# EAGLE schematic PCB1_v1 (EAGLE 9.3.1)

## Sheet 1 of 4: Light Sensor
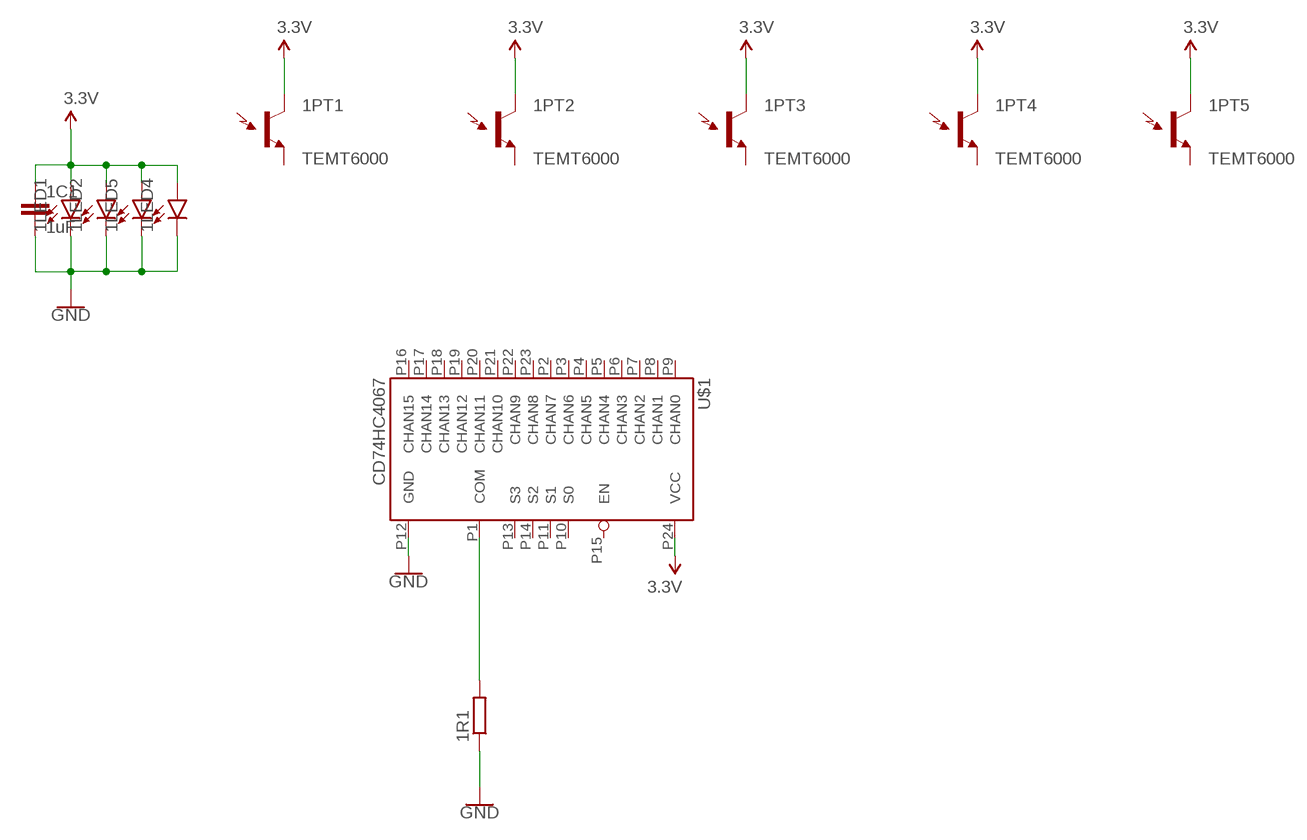
[diagram p0: schematic, sheet 1]

### Parts
1C1  1uF  C-EUC0603  [C0603]
1LED1  3528LED  [3528]
1LED2  3528LED  [3528]
1LED4  3528LED  [3528]
1LED5  3528LED  [3528]
1PT1  TEMT6000  LIGHT_SENSORTEMT6000  [TEMT6000]
1PT2  TEMT6000  LIGHT_SENSORTEMT6000  [TEMT6000]
1PT3  TEMT6000  LIGHT_SENSORTEMT6000  [TEMT6000]
1PT4  TEMT6000  LIGHT_SENSORTEMT6000  [TEMT6000]
1PT5  TEMT6000  LIGHT_SENSORTEMT6000  [TEMT6000]
1R1  2k  R-EU_R0603  [R0603]
U$1  CD74HC4067  [SOIC-24]

### Nets
3.3V: 1C1.1 1LED1.A 1LED2.A 1LED4.A 1LED5.A 1PT1.COLLECTOR(C1) 1PT2.COLLECTOR(C1) 1PT3.COLLECTOR(C1) 1PT4.COLLECTOR(C1) 1PT5.COLLECTOR(C1) U$1.P24(VCC) ; also sheet 2,3
GND: 1C1.2 1LED1.C 1LED2.C 1LED4.C 1LED5.C 1R1.1 U$1.P12(GND) ; also sheet 2,3
N$1: 1R1.2 U$1.P1(COM)
Unconnected: 1PT1.EMITTER(E1) 1PT2.EMITTER(E1) 1PT3.EMITTER(E1) 1PT4.EMITTER(E1) 1PT5.EMITTER(E1) U$1.P2(CHAN7) U$1.P3(CHAN6) U$1.P4(CHAN5) U$1.P5(CHAN4) U$1.P6(CHAN3) U$1.P7(CHAN2) U$1.P8(CHAN1) U$1.P9(CHAN0) U$1.P10(S0) U$1.P11(S1) U$1.P13(S3) U$1.P14(S2) U$1.P15(EN) U$1.P16(CHAN15) U$1.P17(CHAN14) U$1.P18(CHAN13) U$1.P19(CHAN12) U$1.P20(CHAN11) U$1.P21(CHAN10) U$1.P22(CHAN9) U$1.P23(CHAN8)

## Sheet 2 of 4: Motor Driver
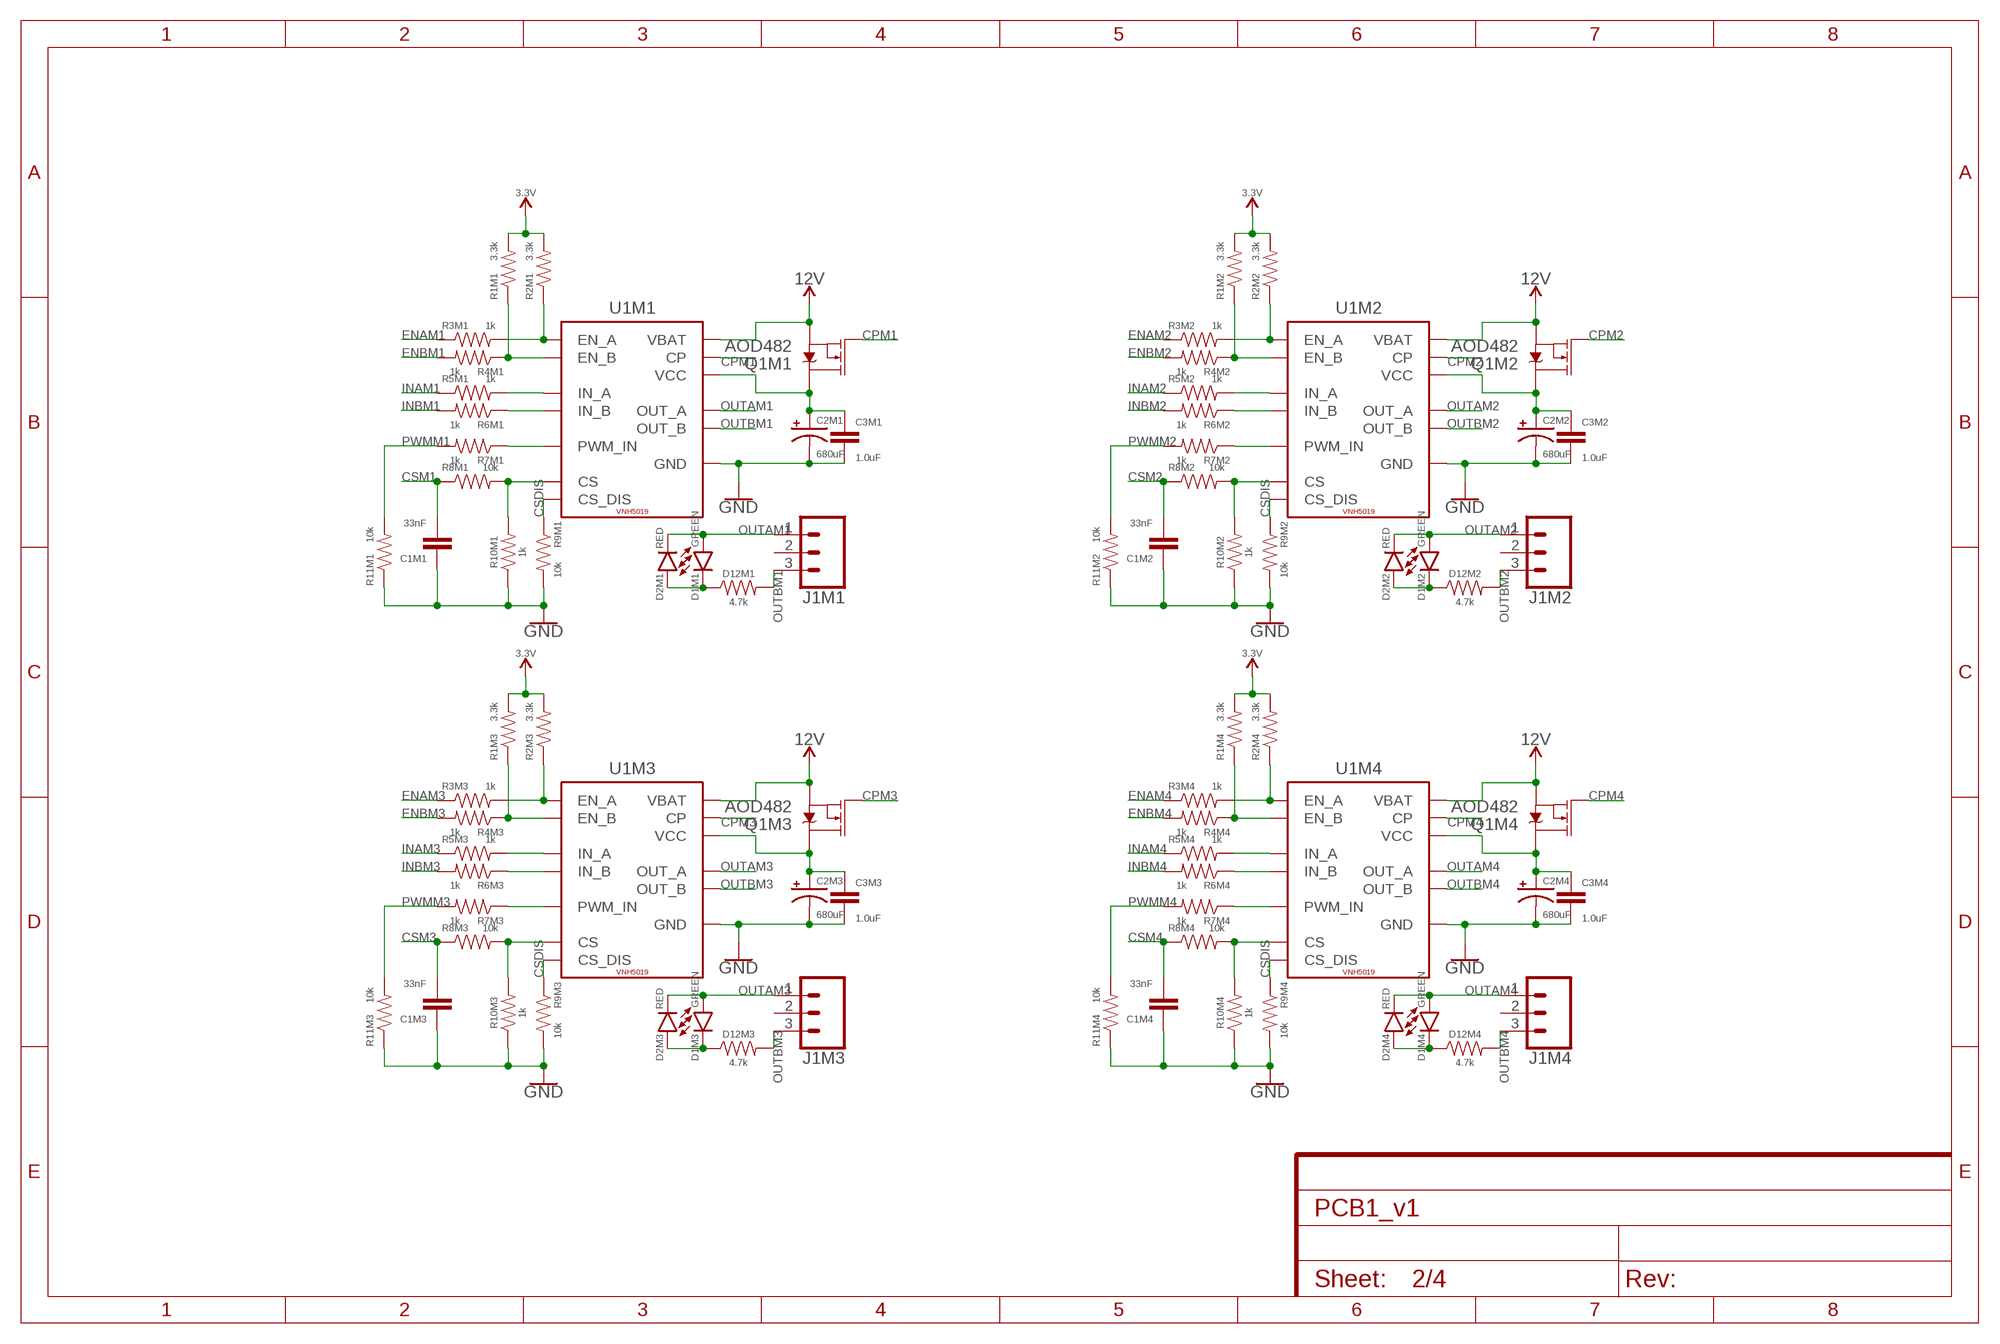
[diagram p1: schematic, sheet 2]

### Parts
C1M1  33nF  33NF-0603-50V-10%  [0603]
C1M2  33nF  33NF-0603-50V-10%  [0603]
C1M3  33nF  33NF-0603-50V-10%  [0603]
C1M4  33nF  33NF-0603-50V-10%  [0603]
C2M1  680uF  CPOL-USE3.5-8  [E3,5-8]
C2M2  680uF  CPOL-USE3.5-8  [E3,5-8]
C2M3  680uF  CPOL-USE3.5-8  [E3,5-8]
C2M4  680uF  CPOL-USE3.5-8  [E3,5-8]
C3M1  1.0uF  1.0UF-0603-16V-10%-X7R  [0603]
C3M2  1.0uF  1.0UF-0603-16V-10%-X7R  [0603]
C3M3  1.0uF  1.0UF-0603-16V-10%-X7R  [0603]
C3M4  1.0uF  1.0UF-0603-16V-10%-X7R  [0603]
D1M1  GREEN  LED-GREEN1206  [LED-1206]
D1M2  GREEN  LED-GREEN1206  [LED-1206]
D1M3  GREEN  LED-GREEN1206  [LED-1206]
D1M4  GREEN  LED-GREEN1206  [LED-1206]
D2M1  RED  LED-RED1206  [LED-1206]
D2M2  RED  LED-RED1206  [LED-1206]
D2M3  RED  LED-RED1206  [LED-1206]
D2M4  RED  LED-RED1206  [LED-1206]
D12M1  4.7k  4.7KOHM-0603-1/10W-1%  [0603]
D12M2  4.7k  4.7KOHM-0603-1/10W-1%  [0603]
D12M3  4.7k  4.7KOHM-0603-1/10W-1%  [0603]
D12M4  4.7k  4.7KOHM-0603-1/10W-1%  [0603]
J1M1  CONN_03-SCREW-5MM  [SCREWTERMINAL-5MM-3]
J1M2  CONN_03-SCREW-5MM  [SCREWTERMINAL-5MM-3]
J1M3  CONN_03-SCREW-5MM  [SCREWTERMINAL-5MM-3]
J1M4  CONN_03-SCREW-5MM  [SCREWTERMINAL-5MM-3]
Q1M1  AOD482  MOSFET-NCH-FDD8780  [DPAK]
Q1M2  AOD482  MOSFET-NCH-FDD8780  [DPAK]
Q1M3  AOD482  MOSFET-NCH-FDD8780  [DPAK]
Q1M4  AOD482  MOSFET-NCH-FDD8780  [DPAK]
R1M1  3.3k  3.3KOHM-0603-1/10W-1%  [0603]
R1M2  3.3k  3.3KOHM-0603-1/10W-1%  [0603]
R1M3  3.3k  3.3KOHM-0603-1/10W-1%  [0603]
R1M4  3.3k  3.3KOHM-0603-1/10W-1%  [0603]
R2M1  3.3k  3.3KOHM-0603-1/10W-1%  [0603]
R2M2  3.3k  3.3KOHM-0603-1/10W-1%  [0603]
R2M3  3.3k  3.3KOHM-0603-1/10W-1%  [0603]
R2M4  3.3k  3.3KOHM-0603-1/10W-1%  [0603]
R3M1  1k  1KOHM-0603-1/10W-1%  [0603]
R3M2  1k  1KOHM-0603-1/10W-1%  [0603]
R3M3  1k  1KOHM-0603-1/10W-1%  [0603]
R3M4  1k  1KOHM-0603-1/10W-1%  [0603]
R4M1  1k  1KOHM-0603-1/10W-1%  [0603]
R4M2  1k  1KOHM-0603-1/10W-1%  [0603]
R4M3  1k  1KOHM-0603-1/10W-1%  [0603]
R4M4  1k  1KOHM-0603-1/10W-1%  [0603]
R5M1  1k  1KOHM-0603-1/10W-1%  [0603]
R5M2  1k  1KOHM-0603-1/10W-1%  [0603]
R5M3  1k  1KOHM-0603-1/10W-1%  [0603]
R5M4  1k  1KOHM-0603-1/10W-1%  [0603]
R6M1  1k  1KOHM-0603-1/10W-1%  [0603]
R6M2  1k  1KOHM-0603-1/10W-1%  [0603]
R6M3  1k  1KOHM-0603-1/10W-1%  [0603]
R6M4  1k  1KOHM-0603-1/10W-1%  [0603]
R7M1  1k  1KOHM-0603-1/10W-1%  [0603]
R7M2  1k  1KOHM-0603-1/10W-1%  [0603]
R7M3  1k  1KOHM-0603-1/10W-1%  [0603]
R7M4  1k  1KOHM-0603-1/10W-1%  [0603]
R8M1  10k  10KOHM-0603-1/10W-1%  [0603]
R8M2  10k  10KOHM-0603-1/10W-1%  [0603]
R8M3  10k  10KOHM-0603-1/10W-1%  [0603]
R8M4  10k  10KOHM-0603-1/10W-1%  [0603]
R9M1  10k  10KOHM-0603-1/10W-1%  [0603]
R9M2  10k  10KOHM-0603-1/10W-1%  [0603]
R9M3  10k  10KOHM-0603-1/10W-1%  [0603]
R9M4  10k  10KOHM-0603-1/10W-1%  [0603]
R10M1  1k  1KOHM-0603-1/10W-1%  [0603]
R10M2  1k  1KOHM-0603-1/10W-1%  [0603]
R10M3  1k  1KOHM-0603-1/10W-1%  [0603]
R10M4  1k  1KOHM-0603-1/10W-1%  [0603]
R11M1  10k  10KOHM-0603-1/10W-1%  [0603]
R11M2  10k  10KOHM-0603-1/10W-1%  [0603]
R11M3  10k  10KOHM-0603-1/10W-1%  [0603]
R11M4  10k  10KOHM-0603-1/10W-1%  [0603]
U1M1  VNH5019  [POWERSO-30]
U1M2  VNH5019  [POWERSO-30]
U1M3  VNH5019  [POWERSO-30]
U1M4  VNH5019  [POWERSO-30]

### Nets
3.3V: R1M1.2 R1M2.2 R1M3.2 R1M4.2 R2M1.2 R2M2.2 R2M3.2 R2M4.2 ; also sheet 1,3
12V: Q1M1.3(S) Q1M2.3(S) Q1M3.3(S) Q1M4.3(S) U1M1.P12(VBAT) U1M2.P12(VBAT) U1M3.P12(VBAT) U1M4.P12(VBAT) ; also sheet 3
CPM1: Q1M1.1(G) U1M1.P11(CP)
CPM2: Q1M2.1(G) U1M2.P11(CP)
CPM3: Q1M3.1(G) U1M3.P11(CP)
CPM4: Q1M4.1(G) U1M4.P11(CP)
CSDIS: R9M1.1 R9M2.1 R9M3.1 R9M4.1 U1M1.P6(CS_DIS) U1M2.P6(CS_DIS) U1M3.P6(CS_DIS) U1M4.P6(CS_DIS)
CSM1: C1M1.2 R8M1.1
CSM2: C1M2.2 R8M2.1
CSM3: C1M3.2 R8M3.1
CSM4: C1M4.2 R8M4.1
ENAM1: R3M1.1
ENAM2: R3M2.1
ENAM3: R3M3.1
ENAM4: R3M4.1
ENBM1: R4M1.2
ENBM2: R4M2.2
ENBM3: R4M3.2
ENBM4: R4M4.2
GND: C1M1.1 C1M2.1 C1M3.1 C1M4.1 C2M1.- C2M2.- C2M3.- C2M4.- C3M1.2 C3M2.2 C3M3.2 C3M4.2 R9M1.2 R9M2.2 R9M3.2 R9M4.2 R10M1.1 R10M2.1 R10M3.1 R10M4.1 R11M1.1 R11M2.1 R11M3.1 R11M4.1 U1M1.P18(GND) U1M1.P19(GND) U1M1.P20(GND) U1M1.P26(GND) U1M1.P27(GND) U1M1.P28(GND) U1M2.P18(GND) U1M2.P19(GND) U1M2.P20(GND) U1M2.P26(GND) U1M2.P27(GND) U1M2.P28(GND) U1M3.P18(GND) U1M3.P19(GND) U1M3.P20(GND) U1M3.P26(GND) U1M3.P27(GND) U1M3.P28(GND) U1M4.P18(GND) U1M4.P19(GND) U1M4.P20(GND) U1M4.P26(GND) U1M4.P27(GND) U1M4.P28(GND) ; also sheet 1,3
INAM1: R5M1.1
INAM2: R5M2.1
INAM3: R5M3.1
INAM4: R5M4.1
INBM1: R6M1.2
INBM2: R6M2.2
INBM3: R6M3.2
INBM4: R6M4.2
N$2: R2M1.1 R3M1.2 U1M1.P5(EN_A)
N$3: C2M1.+ C3M1.1 Q1M1.4(D) U1M1.P3(VCC) U1M1.P13(VCC) U1M1.P23(VCC) U1M1.SLUG1(VCC)
N$4: R1M1.1 R4M1.1 U1M1.P9(EN_B)
N$5: R6M1.1 U1M1.P10(IN_B)
N$6: R5M1.2 U1M1.P4(IN_A)
N$7: R8M1.2 R10M1.2 U1M1.P8(CS)
N$8: R7M1.1 U1M1.P7(PWM_IN)
N$9: C2M2.+ C3M2.1 Q1M2.4(D) U1M2.P3(VCC) U1M2.P13(VCC) U1M2.P23(VCC) U1M2.SLUG1(VCC)
N$10: R2M2.1 R3M2.2 U1M2.P5(EN_A)
N$11: R5M2.2 U1M2.P4(IN_A)
N$12: D1M1.C D2M1.A D12M1.1
N$13: R1M2.1 R4M2.1 U1M2.P9(EN_B)
N$14: R6M2.1 U1M2.P10(IN_B)
N$15: R8M2.2 R10M2.2 U1M2.P8(CS)
N$16: R7M2.1 U1M2.P7(PWM_IN)
N$17: D1M2.C D2M2.A D12M2.1
N$18: C2M3.+ C3M3.1 Q1M3.4(D) U1M3.P3(VCC) U1M3.P13(VCC) U1M3.P23(VCC) U1M3.SLUG1(VCC)
N$19: R2M3.1 R3M3.2 U1M3.P5(EN_A)
N$20: R5M3.2 U1M3.P4(IN_A)
N$21: R1M3.1 R4M3.1 U1M3.P9(EN_B)
N$22: R6M3.1 U1M3.P10(IN_B)
N$23: R8M3.2 R10M3.2 U1M3.P8(CS)
N$24: R7M3.1 U1M3.P7(PWM_IN)
N$25: D1M3.C D2M3.A D12M3.1
N$26: C2M4.+ C3M4.1 Q1M4.4(D) U1M4.P3(VCC) U1M4.P13(VCC) U1M4.P23(VCC) U1M4.SLUG1(VCC)
N$27: R2M4.1 R3M4.2 U1M4.P5(EN_A)
N$28: R5M4.2 U1M4.P4(IN_A)
N$29: R1M4.1 R4M4.1 U1M4.P9(EN_B)
N$30: R6M4.1 U1M4.P10(IN_B)
N$31: R8M4.2 R10M4.2 U1M4.P8(CS)
N$32: R7M4.1 U1M4.P7(PWM_IN)
N$33: D1M4.C D2M4.A D12M4.1
OUTAM1: D1M1.A D2M1.C J1M1.1 U1M1.P1(OUT_A) U1M1.P25(OUT_A) U1M1.P30(OUT_A) U1M1.SLUG2(OUT_A)
OUTAM2: D1M2.A D2M2.C J1M2.1 U1M2.P1(OUT_A) U1M2.P25(OUT_A) U1M2.P30(OUT_A) U1M2.SLUG2(OUT_A)
OUTAM3: D1M3.A D2M3.C J1M3.1 U1M3.P1(OUT_A) U1M3.P25(OUT_A) U1M3.P30(OUT_A) U1M3.SLUG2(OUT_A)
OUTAM4: D1M4.A D2M4.C J1M4.1 U1M4.P1(OUT_A) U1M4.P25(OUT_A) U1M4.P30(OUT_A) U1M4.SLUG2(OUT_A)
OUTBM1: D12M1.2 J1M1.3 U1M1.P15(OUT_B) U1M1.P16(OUT_B) U1M1.P21(OUT_B) U1M1.SLUG3(OUT_B)
OUTBM2: D12M2.2 J1M2.3 U1M2.P15(OUT_B) U1M2.P16(OUT_B) U1M2.P21(OUT_B) U1M2.SLUG3(OUT_B)
OUTBM3: D12M3.2 J1M3.3 U1M3.P15(OUT_B) U1M3.P16(OUT_B) U1M3.P21(OUT_B) U1M3.SLUG3(OUT_B)
OUTBM4: D12M4.2 J1M4.3 U1M4.P15(OUT_B) U1M4.P16(OUT_B) U1M4.P21(OUT_B) U1M4.SLUG3(OUT_B)
PWMM1: R7M1.2 R11M1.2
PWMM2: R7M2.2 R11M2.2
PWMM3: R7M3.2 R11M3.2
PWMM4: R7M4.2 R11M4.2
Unconnected: J1M1.2 J1M2.2 J1M3.2 J1M4.2 U1M1.P2(NC) U1M1.P14(NC) U1M1.P17(NC) U1M1.P22(NC) U1M1.P24(NC) U1M1.P29(NC) U1M2.P2(NC) U1M2.P14(NC) U1M2.P17(NC) U1M2.P22(NC) U1M2.P24(NC) U1M2.P29(NC) U1M3.P2(NC) U1M3.P14(NC) U1M3.P17(NC) U1M3.P22(NC) U1M3.P24(NC) U1M3.P29(NC) U1M4.P2(NC) U1M4.P14(NC) U1M4.P17(NC) U1M4.P22(NC) U1M4.P24(NC) U1M4.P29(NC)

## Sheet 3 of 4: Boost & Step Down
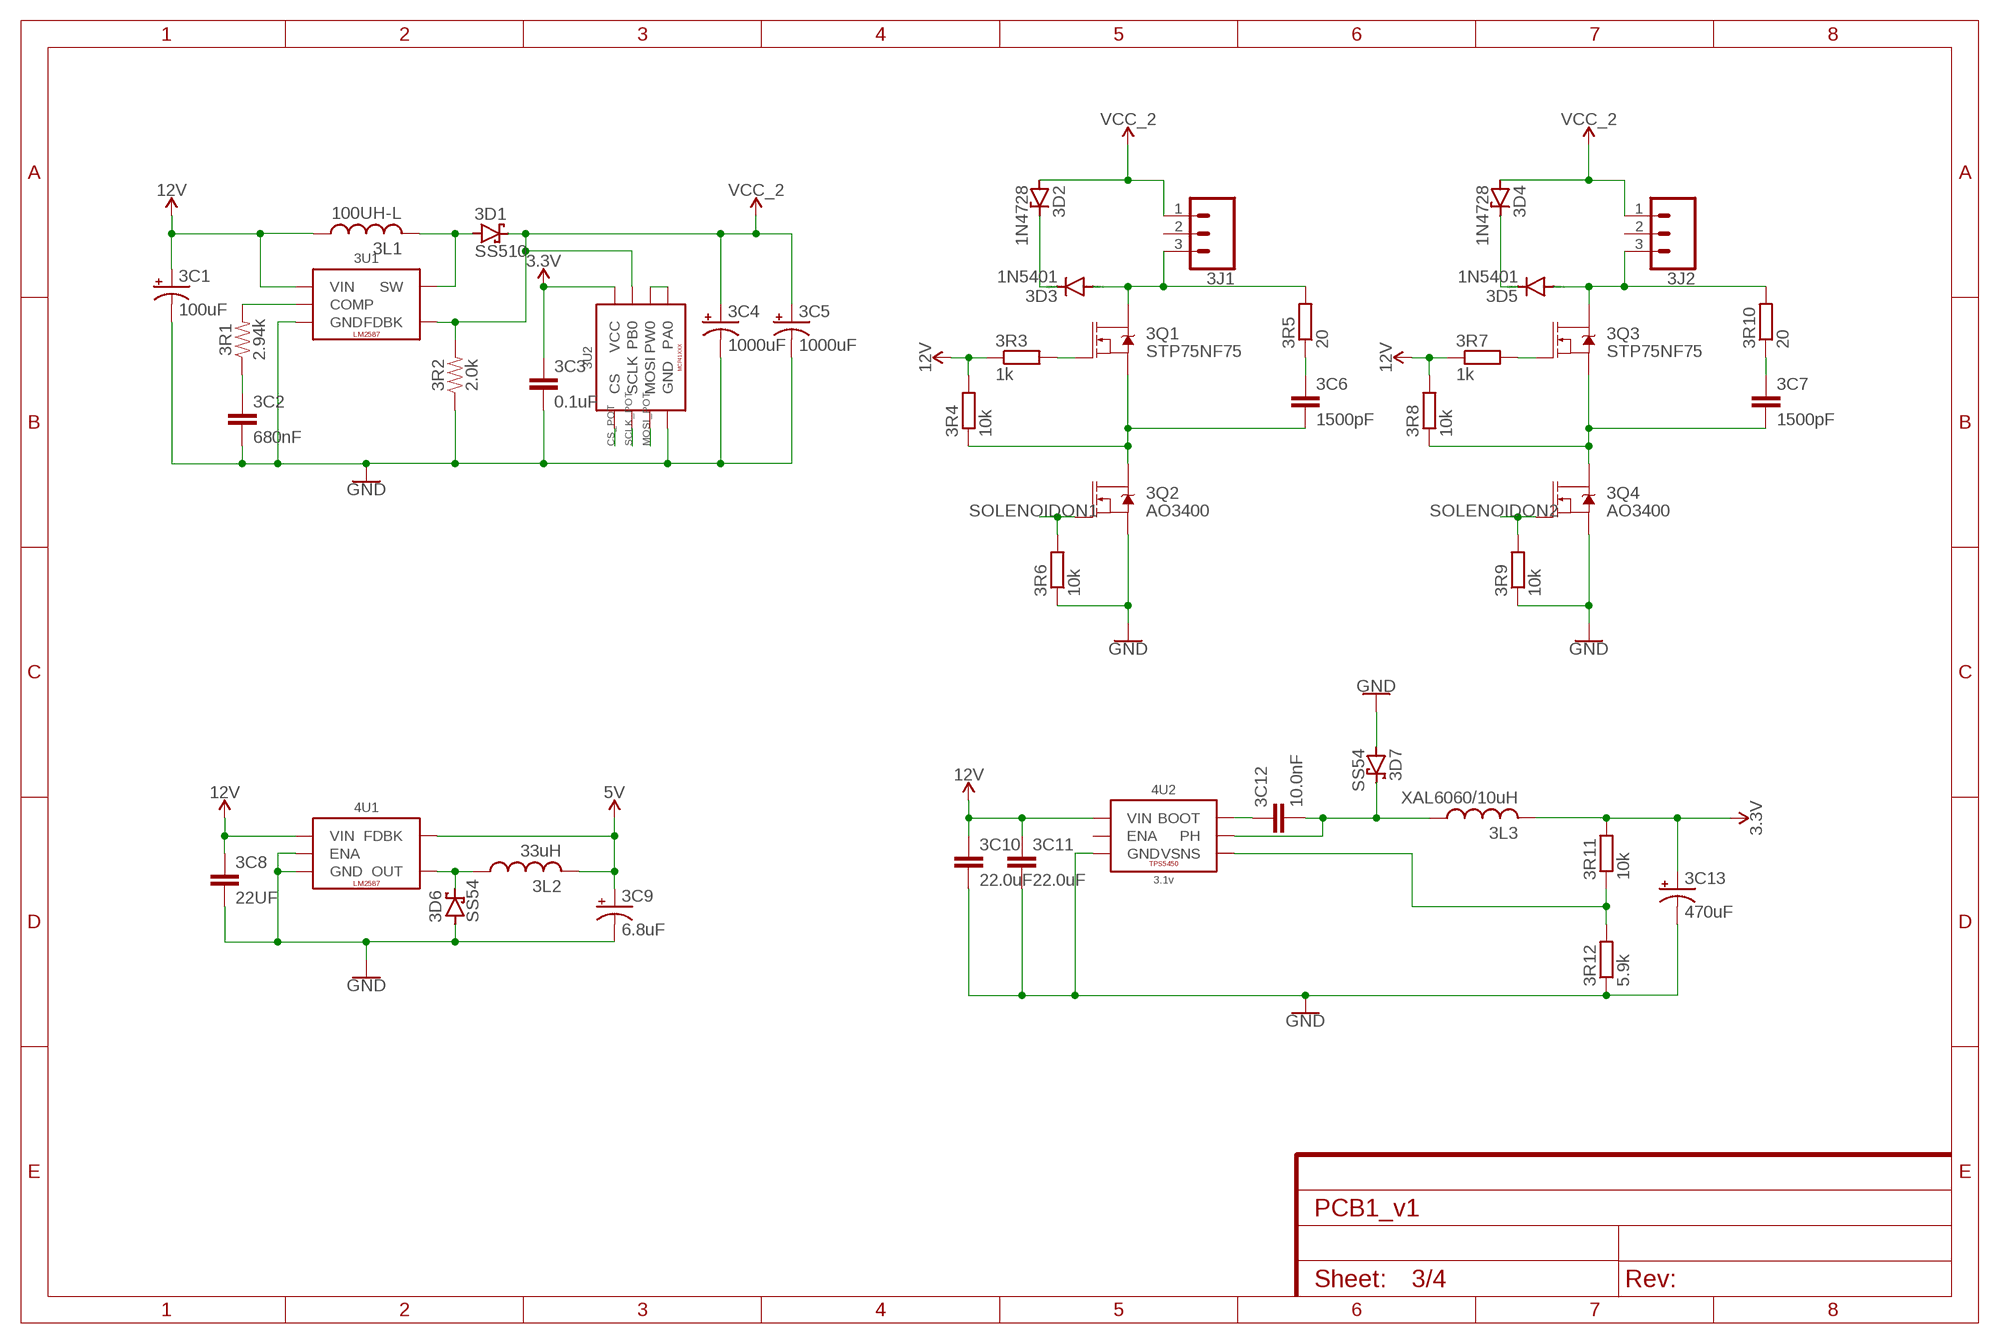
[diagram p2: schematic, sheet 3]

### Parts
3C1  100uF  100UF-POLAR-25V-20%(ELEC)  [PANASONIC_D]
3C2  680nF  680PF-0603-50V-10%  [0603]
3C3  0.1uF  0.1UF-0603-25V-5%  [0603]
3C4  1000uF  1000UF-CAP  [1000UF-CAP]
3C5  1000uF  1000UF-CAP  [1000UF-CAP]
3C6  1500pF  C-EUC0603  [C0603]
3C7  1500pF  C-EUC0603  [C0603]
3C8  22UF  22UF-1210-16V-20%  [1210]
3C9  6.8uF  CPOL-USA/3216-18R  [A/3216-18R]
3C10  22.0uF  C-EUC1210  [C1210]
3C11  22.0uF  C-EUC1210  [C1210]
3C12  10.0nF  C-EUC0603  [C0603]
3C13  470uF  CPOL-USD/7343-31R  [D/7343-31R]
3D1  SS510  SCHOTTKY-DIODESMD  [SMB]
3D2  1N4728  [DO41Z10]
3D3  1N5401  1N5400  [DO201-15]
3D4  1N4728  [DO41Z10]
3D5  1N5401  1N5400  [DO201-15]
3D6  SS54  SCHOTTKY-DIODESMD  [SMB]
3D7  SS54  SCHOTTKY-DIODESMD  [SMB]
3J1  CONN_03-SCREW-5MM  [SCREWTERMINAL-5MM-3]
3J2  CONN_03-SCREW-5MM  [SCREWTERMINAL-5MM-3]
3L1  100UH-L  [100UH-L]
3L2  33uH  CDRH127  [127]
3L3  XAL6060/10uH  XAL6060  [XAL6060]
3Q1  STP75NF75  MOSFET-NCH-FQP30N06L  [TO220V]
3Q2  AO3400  MOSFET-NCH-AO3404A  [SOT23-3]
3Q3  STP75NF75  MOSFET-NCH-FQP30N06L  [TO220V]
3Q4  AO3400  MOSFET-NCH-AO3404A  [SOT23-3]
3R1  2.94k  RESISTOR0603  [0603]
3R2  2.0k  2.0KOHM-0603-1/10W-5%  [0603]
3R3  1k  R-EU_R0603  [R0603]
3R4  10k  R-EU_R0603  [R0603]
3R5  20  R-EU_R0603  [R0603]
3R6  10k  R-EU_R0603  [R0603]
3R7  1k  R-EU_R0603  [R0603]
3R8  10k  R-EU_R0603  [R0603]
3R9  10k  R-EU_R0603  [R0603]
3R10  20  R-EU_R0603  [R0603]
3R11  10k  R-EU_R0603  [R0603]
3R12  5.9k  R-EU_R0603  [R0603]
3U1  LM2587  [TO-263]
3U2  MCP41XXX  [SOIC-8]
4U1  LM2596  [TO-263]
4U2  3.1v  TPS5450  [POWERPAD-SOIC-8]

### Nets
3.3V: 3C3.1 3C13.+ 3L3.2 3R11.2 3U2.8(VCC) ; also sheet 1,2
5V: 3C9.+ 3L2.2 4U1.P4(FDBK)
12V: 3C1.+ 3C8.1 3C10.1 3C11.1 3L1.P1 3R3.1 3R4.2 3R7.1 3R8.2 3U1.P5(VIN) 4U1.P1(VIN) 4U2.7(VIN) ; also sheet 2
CS_POT: 3U2.1(CS)
GND: 3C1.- 3C2.2 3C3.2 3C4.- 3C5.- 3C8.2 3C9.- 3C10.2 3C11.2 3C13.- 3D6.A 3D7.A 3Q2.2(S) 3Q4.2(S) 3R2.1 3R6.1 3R9.1 3R12.1 3U1.P3(GND) 3U2.4(GND) 4U1.P3(GND) 4U1.P5(ENA) 4U1.TAB(GND) 4U2.6(GND) 4U2.9(GND) 4U2.P$1(GND) 4U2.P$2(GND) 4U2.P$3(GND) 4U2.P$4(GND) 4U2.P$5(GND) 4U2.P$6(GND) ; also sheet 1,2
MOSI_POT: 3U2.3(MOSI)
N$34: 3D1.A 3L1.P2 3U1.P4(SW)
N$35: 3C6.2 3Q1.3(S) 3Q2.3(D) 3R4.1
N$36: 3R1.2 3U1.P1(COMP)
N$37: 3C2.1 3R1.1
N$38: 3Q1.1(G) 3R3.2
N$39: 3D2.C 3D3.C
N$40: 3C6.1 3R5.1
N$41: 3U2.5(PA0) 3U2.6(PW0)
N$42: 3C7.2 3Q3.3(S) 3Q4.3(D) 3R8.1
N$43: 3Q3.1(G) 3R7.2
N$44: 3D4.C 3D5.C
N$45: 3C7.1 3R10.1
N$46: 3C12.1 4U2.1(BOOT)
N$47: 3D6.C 3L2.1 4U1.P2(OUT)
N$48: 3C12.2 3D7.C 3L3.1 4U2.8(PH)
N$49: 3R11.1 3R12.2 4U2.4(VSNS)
SCLK_POT: 3U2.2(SCLK)
SOLENOID-: 3D3.A 3J1.3 3Q1.2(D) 3R5.2
SOLENOID-1: 3D5.A 3J2.3 3Q3.2(D) 3R10.2
SOLENOIDON1: 3Q2.1(G) 3R6.2
SOLENOIDON2: 3Q4.1(G) 3R9.2
VCC_2: 3C4.+ 3C5.+ 3D1.C 3D2.A 3D4.A 3J1.1 3J2.1 3R2.2 3U1.P2(FDBK) 3U2.7(PB0)
Unconnected: 3J1.2 3J2.2 4U2.2(NC) 4U2.3(NC) 4U2.5(ENA)

## Sheet 4 of 4
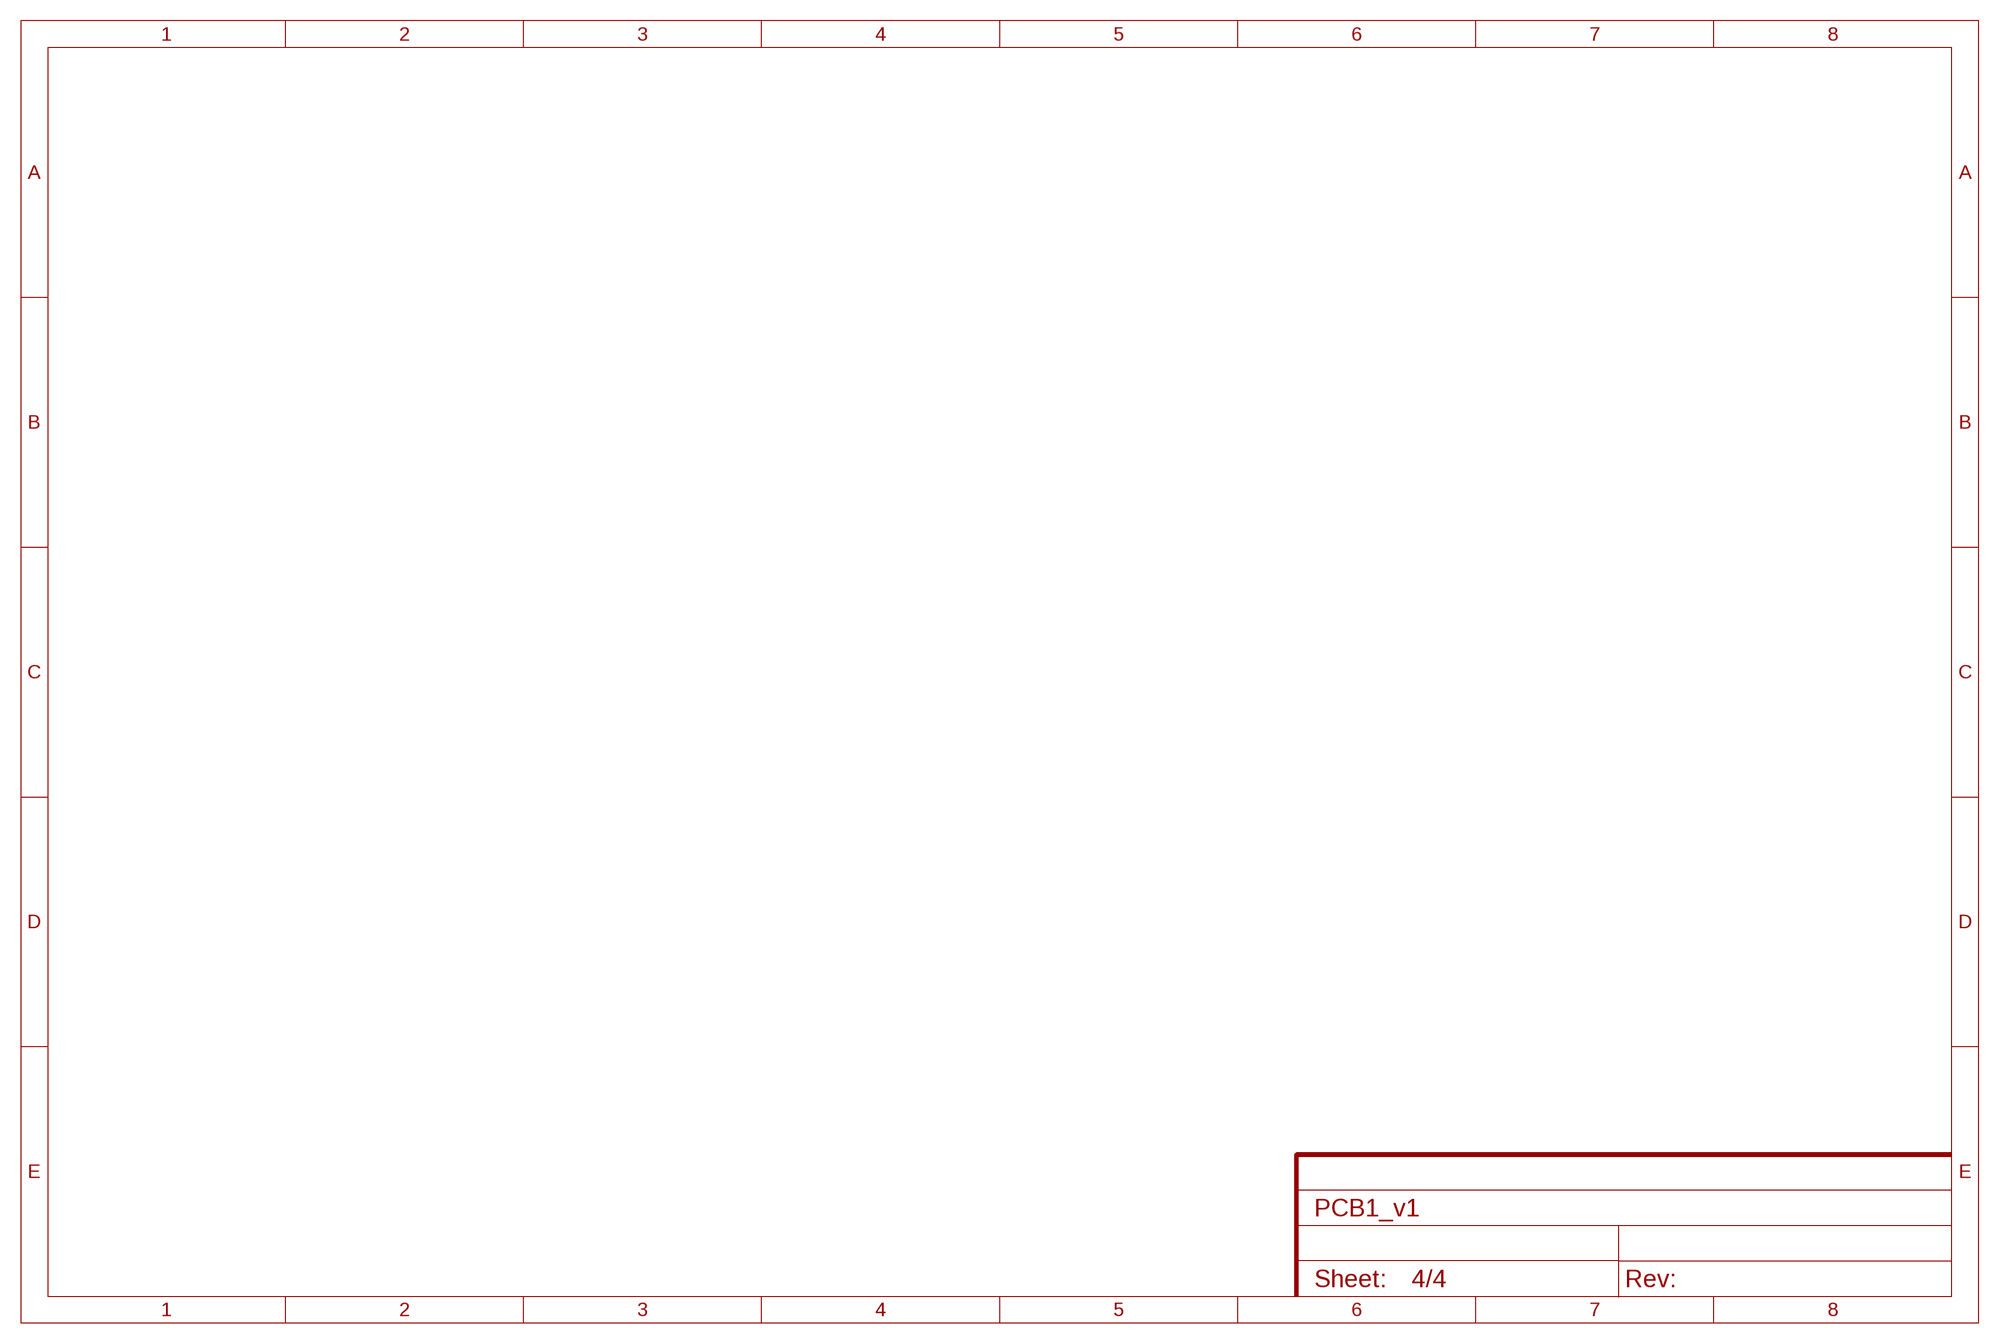
[diagram p3: schematic, sheet 4]

## Library data of the parts
1C1 3C6 3C7 3C10-3C12 = rcl:C-EU: CAPACITOR, European symbol; SPICEPREFIX: C
1LED1 1LED2 1LED4 1LED5 = JH:3528LED
1PT1-1PT5 = SparkFun-Sensors:LIGHT_SENSOR: Ambient Light Sensors - Phototransistors Low cost ambient light sensors, consisting of a phototransistor in miniature SMD packages. Output voltage varies with light intensity. SparkFun Products ALS-PT19 Light Sensor <https://www.sparkfun.com/products/12566> (SEN-12566) Ambient Light Sensor - TEMT6000 <https://www.sparkfun.com/products/8348> (SEN-08348) SparkFun Ambient Light Sensor Breakout - TEMT60000 <https://www.sparkfun.com/products/8688> (SEN-08688); PROD_ID: COMP-08569; SF_ID: COM-08348
1R1 3R3-3R12 = rcl:R-EU_: RESISTOR, European symbol; SPICEPREFIX: R
3C1 = SparkFun-Capacitors:100UF-POLAR: 100µF polarized capacitors A capacitor is a passive two-terminal electrical component used to store electrical energy temporarily in an electric field.; PROD_ID: CAP-12547
3C2 = SparkFun-Capacitors:680PF: 680pF/0.68nF ceramic capacitors A capacitor is a passive two-terminal electrical component used to store electrical energy temporarily in an electric field.; PROD_ID: CAP-09232; VALUE: 680pF
3C3 = SparkFun-Capacitors:0.1UF: 0.1µF ceramic capacitors A capacitor is a passive two-terminal electrical component used to store electrical energy temporarily in an electric field.; PROD_ID: CAP-08604
3C4 3C5 = JH:1000UF-CAP
3C8 = SparkFun-Capacitors:22UF: 22µF ceramic capacitors A capacitor is a passive two-terminal electrical component used to store electrical energy temporarily in an electric field.
3C9 3C13 C2M1-C2M4 = rcl:CPOL-US: POLARIZED CAPACITOR, American symbol; SPICEPREFIX: C
3D1 3D6 3D7 = diode:SCHOTTKY-DIODE: Schottky Diode
3D2 3D4 = diode:1N4728: Z DIODE 3.3 V, 1W, 5 percent
3D3 3D5 = diode:1N5400: DIODE standard rectifier, 3 A, 50 V (Motorola)
3J1 3J2 J1M1-J1M4 = SparkFun-Connectors:CONN_03: Multi connection point. Often used as Generic Header-pin footprint for 0.1 inch spaced/style header connections On any of the 0.1 inch spaced packages, you can populate with these: Break Away Headers - Straight <https://www.sparkfun.com/products/116> (PRT-00116) Break Away Male Headers - Right Angle <https://www.sparkfun.com/products/553> (PRT-00553) Female Headers <https://www.sparkfun.com/products/115> (PRT-00115) Break Away Headers - Machine Pin <https://www.sparkfun.com/products/117> (PRT-00117) Break Away Female Headers - Swiss Machine Pin <https://www.sparkfun.com/products/743> (PRT-00743) Stackable Header - 3 Pin (Female, 0.1") <https://www.sparkfun.com/products/13875> (PRT-13875) For SCREWTERMINALS and SPRING TERMINALS visit here: Screw Terimnals on SparkFun.com <https://www.sparkfun.com/search/results?term=Screw+Terminals> (5mm/3.5mm/2.54mm spacing) This device is also useful as a general connection point to wire up your design to another part of your project. Our various solder wires solder well into these plated through hole pads. Hook-Up Wire - Assortment (Stranded, 22 AWG) <https://www.sparkfun.com/products/11375> (PRT-11375) Hook-Up Wire - Assortment (Solid Core, 22 AWG) <https://www.sparkfun.com/products/11367> (PRT-11367) View the entire wire category on our website here <https://www.sparkfun.com/categories/141> Special notes: Molex polarized connector foot print use with SKU : PRT-08232 with associated crimp pins and housings.; PROD_ID: CONN-10134; SF_SKU: PRT-08433
3L1 = JH:100UH-L
3L2 = JH:CDRH127
3L3 = JH:XAL6060
3Q1 3Q3 = SparkFun-DiscreteSemi:MOSFET-NCH: N-channel MOSFETs Voltage controlled devices that allow control of high current outputs. SparkFun Products: SparkFun OpenScale <https://www.sparkfun.com/products/13261> SparkFun Digital Sandbox <https://www.sparkfun.com/products/12651> SparkFun Monster Moto Shield <https://www.sparkfun.com/products/10182> SparkFun MOSFET Power Controller <https://www.sparkfun.com/products/11214>; PROD_ID: TRANS-10060; VALUE: 60V/32A/35mΩ
3Q2 3Q4 = SparkFun-DiscreteSemi:MOSFET-NCH: N-channel MOSFETs Voltage controlled devices that allow control of high current outputs. SparkFun Products: SparkFun OpenScale <https://www.sparkfun.com/products/13261> SparkFun Digital Sandbox <https://www.sparkfun.com/products/12651> SparkFun Monster Moto Shield <https://www.sparkfun.com/products/10182> SparkFun MOSFET Power Controller <https://www.sparkfun.com/products/11214>; PROD_ID: TRANS-12988; VALUE: 5.8A/30V/35mΩ
3R1 = SparkFun-Resistors:RESISTOR: Generic Resistor Package
3R2 = SparkFun-Resistors:2.0KOHM: 2kΩ resistor A resistor is a passive two-terminal electrical component that implements electrical resistance as a circuit element. Resistors act to reduce current flow, and, at the same time, act to lower voltage levels within circuits. - Wikipedia; PROD_ID: RES-08296
3U1 = JH:LM2587
3U2 = JH:MCP41XXX
4U1 = JH:LM2596
4U2 = JH:TPS5450
C1M1-C1M4 = SparkFun-Capacitors:33NF: 33nF ceramic capacitors A capacitor is a passive two-terminal electrical component used to store electrical energy temporarily in an electric field.; PROD_ID: CAP-07887
C3M1-C3M4 = SparkFun-Capacitors:1.0UF: 1µF ceramic capacitors A capacitor is a passive two-terminal electrical component used to store electrical energy temporarily in an electric field.; PROD_ID: CAP-13930
D1M1-D1M4 = SparkFun-LED:LED-GREEN: Green SMD LED Used in manufacturing of various products at SparkFun Packages: 0603 - SMD 0603 package [Product Link] <http://www.futureelectronics.com/en/technologies/semiconductors/optoelectronics/leds/Pages/9894312-LTST-C190GKT.aspx?CrossPart=HSMG-C190&IM=0> LilyPad 1206 - SMD1206 LilyPad package [Product Link] <http://www.futureelectronics.com/en/Technologies/Product.aspx?ProductID=IN150NGHARVATEKCORPORATION2049943&IM=0> 1206 - SMD1206 package [Product Link] <http://www.futureelectronics.com/en/technologies/semiconductors/optoelectronics/leds/Pages/8315665-LTST-C150KGKT.aspx?IM=0> 1206 Bottom Mount -SMD 1206 Bottom Mount [Product Link] <http://www.digikey.com/product-detail/en/lite-on-inc/LTST-C230KGKT/160-1456-1-ND/386854> SparkFun Products: Pro Mini 328 -5V <https://www.sparkfun.com/products/821> RedBoard <https://www.sparkfun.com/products/12757> MP3 Trigger <https://www.sparkfun.com/products/13720> Makey Makey <https://www.sparkfun.com/products/11076>; PROD_ID: DIO-00862
D2M1-D2M4 = SparkFun-LED:LED-RED: Red SMD LED Used in manufacturing of most products at SparkFun Packages: 0603 - SMD 0603 package [Product Link] <http://docs.avagotech.com/docs/AV02-0551EN> 0603 SMART - SMD 0603 SMART package ( more efficient and expensive)[Product Link] <http://www.osram-os.com/Graphics/XPic2/00077099_0.pdf> 1206 - SMD1206 package [Product Link] <https://www.sparkfun.com/datasheets/DevTools/LilyPad/Q150OVS4.pdff> SparkFun Products: Pro Mini 328 -5V <https://www.sparkfun.com/products/821> RedBoard <https://www.sparkfun.com/products/12757> IOIO-OTG <https://www.sparkfun.com/products/13613>; PROD_ID: DIO-09912
D12M1-D12M4 = SparkFun-Resistors:4.7KOHM: 4.7kΩ resistor A resistor is a passive two-terminal electrical component that implements electrical resistance as a circuit element. Resistors act to reduce current flow, and, at the same time, act to lower voltage levels within circuits. - Wikipedia; PROD_ID: RES-07857
Q1M1-Q1M4 = SparkFun-DiscreteSemi:MOSFET-NCH: N-channel MOSFETs Voltage controlled devices that allow control of high current outputs. SparkFun Products: SparkFun OpenScale <https://www.sparkfun.com/products/13261> SparkFun Digital Sandbox <https://www.sparkfun.com/products/12651> SparkFun Monster Moto Shield <https://www.sparkfun.com/products/10182> SparkFun MOSFET Power Controller <https://www.sparkfun.com/products/11214>; PROD_ID: TRANS-09984; VALUE: 35A/25V/8.5mΩ
R1M1-R1M4 R2M1-R2M4 = SparkFun-Resistors:3.3KOHM: 3.3kΩ resistor A resistor is a passive two-terminal electrical component that implements electrical resistance as a circuit element. Resistors act to reduce current flow, and, at the same time, act to lower voltage levels within circuits. - Wikipedia; PROD_ID: RES-07851
R3M1-R3M4 R4M1-R4M4 R5M1-R5M4 R6M1-R6M4 R7M1-R7M4 R10M1-R10M4 = SparkFun-Resistors:1KOHM: 1kΩ resistor A resistor is a passive two-terminal electrical component that implements electrical resistance as a circuit element. Resistors act to reduce current flow, and, at the same time, act to lower voltage levels within circuits. - Wikipedia; PROD_ID: RES-07856
R8M1-R8M4 R9M1-R9M4 R11M1-R11M4 = SparkFun-Resistors:10KOHM: 10kΩ resistor A resistor is a passive two-terminal electrical component that implements electrical resistance as a circuit element. Resistors act to reduce current flow, and, at the same time, act to lower voltage levels within circuits. - Wikipedia; PROD_ID: RES-00824
U1M1-U1M4 = JH:VNH5019
U$1 = JH:CD74HC4067